# Altium schematic sheet circuit de charge.SchDoc
size A4; SheetNumber: 3; SheetTotal: 7
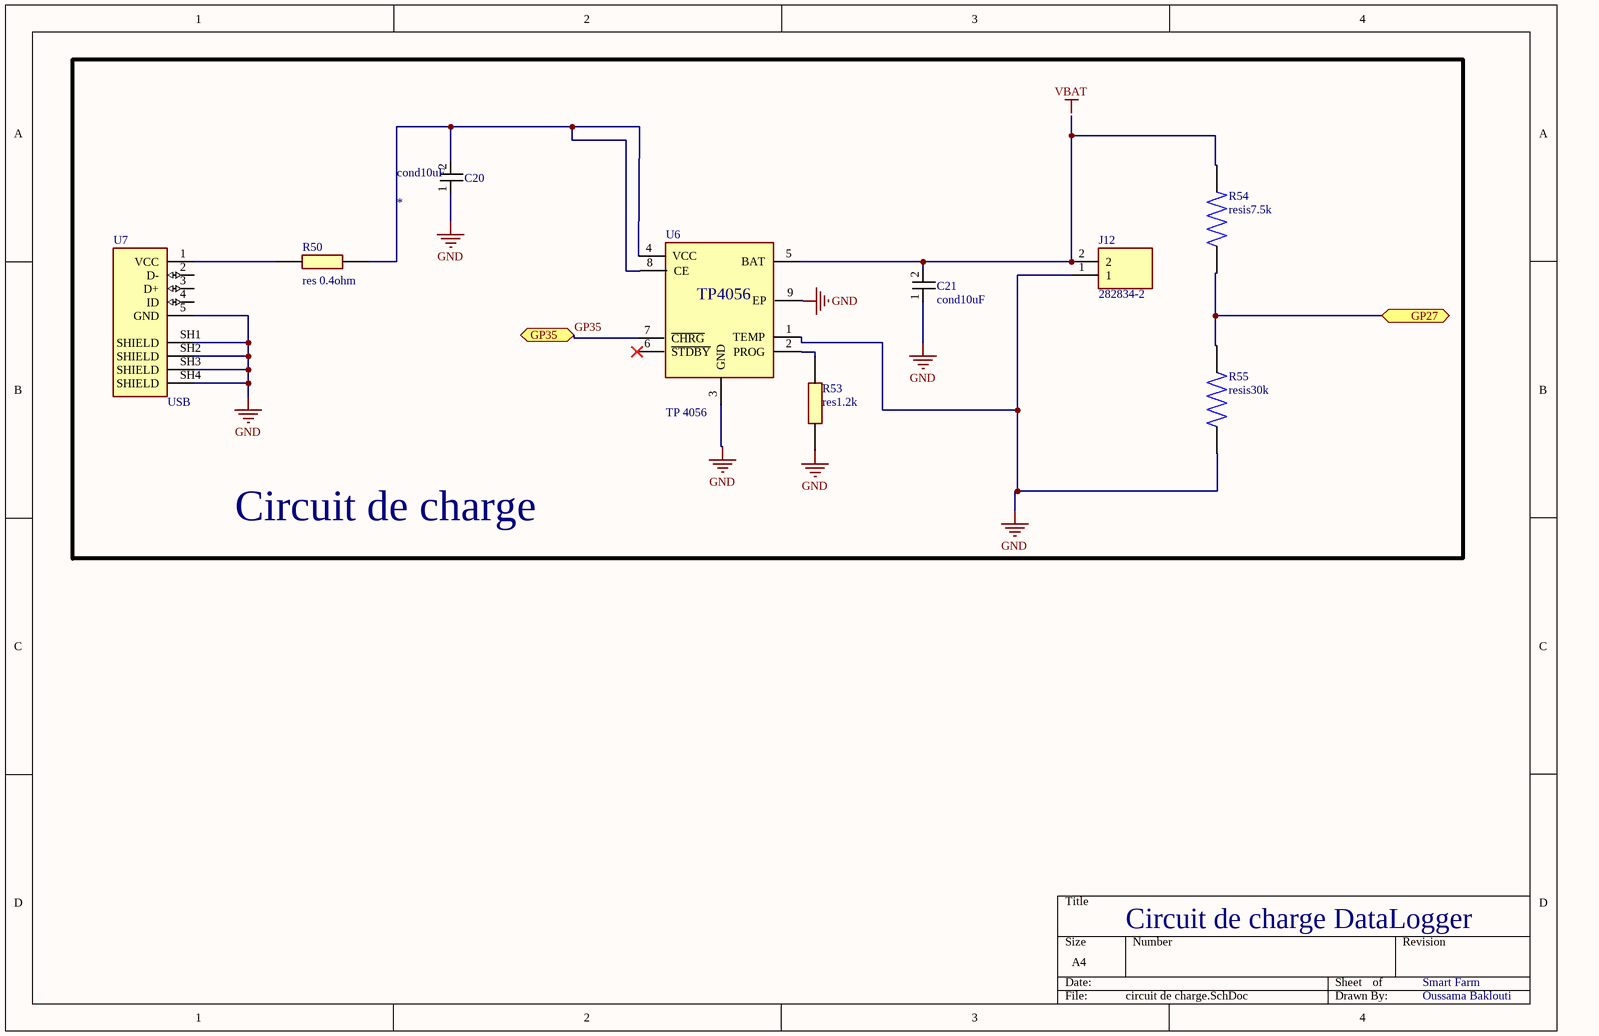
[diagram p0: circuit de charge.SchDoc]

## Parts
C20  cond10uF  [cond10uF]
C21  cond10uF  [cond10uF]
J12  282834-2  [282834-2]
R50  (no value)  [res0.4]
R53  res1.2k  [res1.2k]
R54  resis7.5k  [res7.5k]
R55  resis30k  [res30k]
U6  TP 4056  [TP4056]
U7  (no value)  [USB]

## Blocks framed on the sheet
Circuit de charge: C20 C21 J12 R50 R53-R55 U6 U7

## Ports
GP27 (bidir), GP35 (bidir)

## Nets
GND: C20.1 C21.1 J12.1 R53.1 R55.1 U6.1(TEMP) U6.3(GND) U6.9(EP) U7.5(GND) U7.SH1(SHIELD) U7.SH2(SHIELD) U7.SH3(SHIELD) U7.SH4(SHIELD)
GP27: R54.1 R55.2 ; port GP27
GP35: U6.7(~{CHRG}) ; port GP35
NetC20_2: C20.2 R50.2 U6.4(VCC) U6.8(CE)
NetC21_2: C21.2 J12.2 R54.2 U6.5(BAT)
NetR50_1: R50.1 U7.1(VCC)
NetR53_2: R53.2 U6.2(PROG)

Not connected (* = marked no-connect by the designer): U6 6(~{STDBY})*; U7 2(D-) 3(D+) 4(ID)

## Notes on the sheet
- Circuit de charge DataLogger
- Smart Farm
- Oussama Baklouti
- Labels drawn without touching a wire or pin: VBAT
- (in symbol res0.4) res 0.4ohm
- (in symbol TP 4056) TP4056

## Library data of the parts
C20 = cond10uF: Multilayer Ceramic Capacitors MLCC - SMD/SMT 16V 10uF X7R 1206 10% AEC-Q200; Mfr: KYOCERA AVX; Mfr réf: KAM31GR71C106KU; Suuplier réf: 581-KAM31GR71C106KU; Supplier: Mouser; Parameter 1: *
R50 = res0.4
R54 = resis7.5k: Mfr: YAGEO; Mfr réf: AC0603JR-077K5L; Supplier: DigiKey; Supplier réf: 13-AC0603JR-077K5LDKR-ND
R55 = resis33k: Mfr: YAGEO; Mfr réf: AC0603JR-0733KL; Supplier: DigiKey; Supplier réf: YAG3665DKR-ND
U7 = USB: USB - micro B USB 2.0 Receptacle Connector 5 Position Surface Mount, Right Angle; Mfr: Amphenol ICC (FCI); Mfr Réf: 10104110-0001LF; Supplier: DigiKey; Supplier Réf: 609-4052-6-ND; Footprint: CONN RCPT USB2.0 MICRO B; Price: $0.84